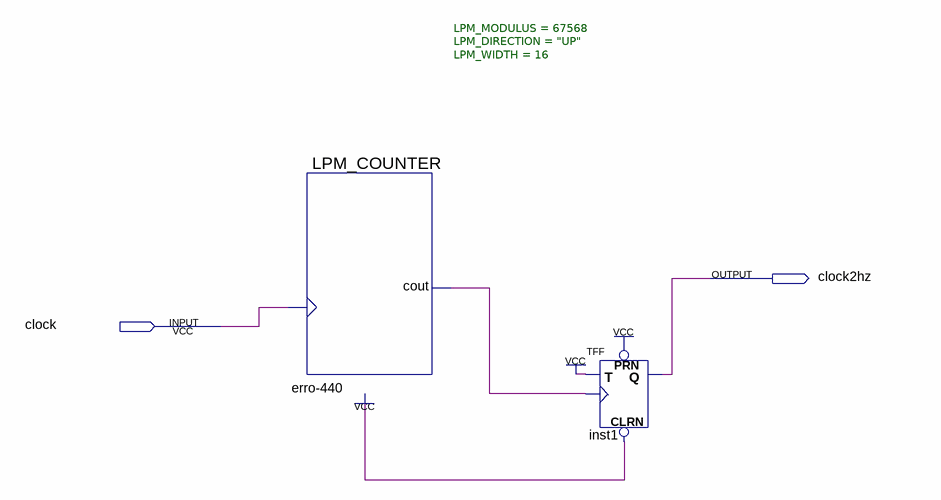
[diagram p0: schematic sheet]
// Quartus schematic divisorClock740hz.bdf as structural Verilog: 2 symbols, 2 pins
module divisorClock740hz (
  input  clock,
  output clock2hz
);

  wire erro_440_cout;

  LPM_COUNTER #(.LPM_MODULUS(67568), .LPM_DIRECTION("UP"), .LPM_WIDTH(16)) \erro-440  (
    .clock(clock), .cout(erro_440_cout));
  TFF inst1 (.PRN(1'b1), .CLRN(1'b1), .T(1'b1), .CLK(erro_440_cout), .Q(clock2hz));
endmodule
